# Altium schematic sheet GR_Alim_Puissance.SchDoc
size A4
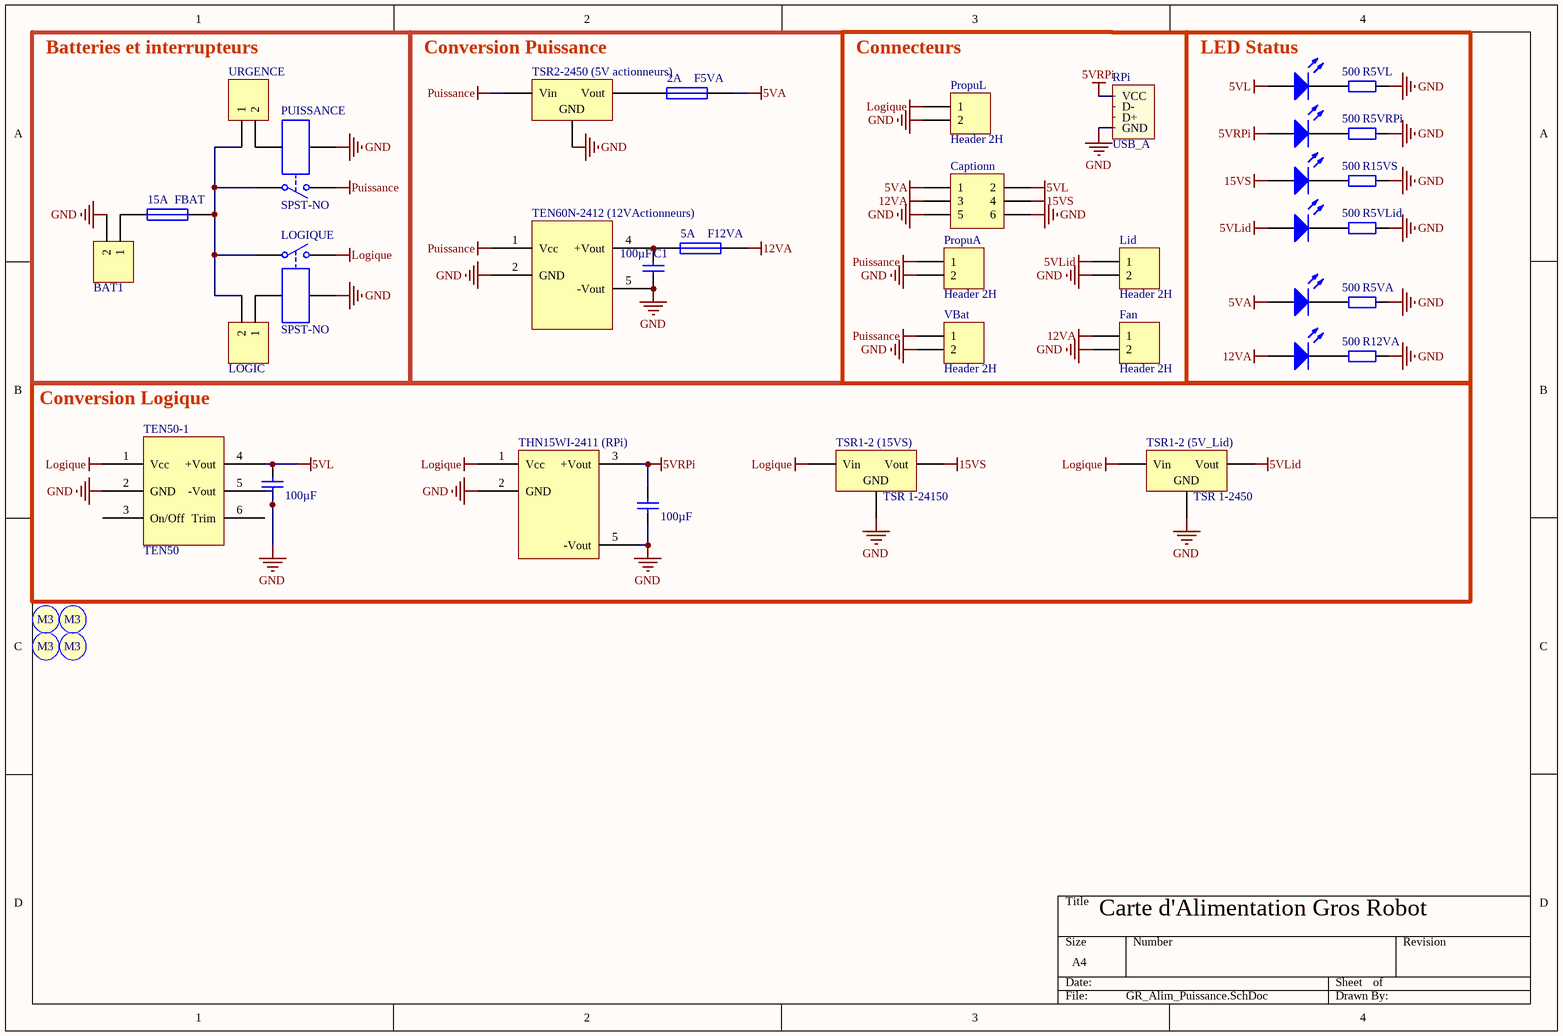
[diagram p0: GR_Alim_Puissance.SchDoc]

## Parts
BAT1  Batterie 1  [Battery SALE]  (value not drawn)
C1  value 100µF  [Condensateur]  (hidden comment: Cap)
C10  value 100µF  [Condensateur]  (hidden comment: Cap)
C20  value 100µF  [Condensateur]  (hidden comment: Cap)
Captionn  Header 3X2  [MOLEX_MINIFITJR_3X2]  (value not drawn)
D1  LED Logique 5V  [3.2X1.6X1.1]  (value not drawn)
D2  LED RPi 5V  [3.2X1.6X1.1]  (value not drawn)
D3  LED Sonars 15V  [3.2X1.6X1.1]  (value not drawn)
D4  LED Actionneurs 5V  [3.2X1.6X1.1]  (value not drawn)
D5  LED Actionneurs 12V  [3.2X1.6X1.1]  (value not drawn)
D6  LED Actionneurs 12V  [3.2X1.6X1.1]  (value not drawn)
F5VA  2A  [Fuse]
F12VA  5A  [Fuse]
Fan  Header 2H  [Molex SPOX 2x1H]
FBAT  15A  [Fuse]
Lid  Header 2H  [Molex_MiniFitJr_2x1H]
LOGIC  Logic  [MOLEX KK254 2X1H M]  (value not drawn)
LOGIQUE  SPST-NO  [Relay]
PropuA  Header 2H  [Molex_MiniFitJr_2x1H]
PropuL  Header 2H  [Molex_MiniFitJr_2x1H]
PUISSANCE  SPST-NO  [Relay]
R5VA  value 500  [3.2X1.6X1.1]  (hidden comment: Res4)
R5VL  value 500  [3.2X1.6X1.1]  (hidden comment: Res1)
R5VLid  value 500  [3.2X1.6X1.1]  (hidden comment: Res5)
R5VRPi  value 500  [3.2X1.6X1.1]  (hidden comment: Res2)
R12VA  value 500  [3.2X1.6X1.1]  (hidden comment: Res5)
R15VS  value 500  [3.2X1.6X1.1]  (hidden comment: Res3)
RPi  USB_A  [USB Connector]
S1  Screw M3  [Screw M3]  (value not drawn)
S2  Screw M3  [Screw M3]  (value not drawn)
S3  Screw M3  [Screw M3]  (value not drawn)
S4  Screw M3  [Screw M3]  (value not drawn)
TEN50-1  TEN50  [TRACO_1x1inch]
TEN60N-1  TEN60N-2412 (12VActionneurs)  [TRACO_2x1inch]
THN15-5  THN15WI-2411 (RPi)  [TRACO_1x1inch]
TSR1-2_(5V_Lid)  TSR 1-2450  [TRS]
TSR1-2_(15VS)  TSR 1-24150  [TRS]
TSR2-1  TSR2-2450 (5V actionneurs)  [TRS - centered]
URGENCE  Urgence  [MOLEX KK254 2X1H M]  (value not drawn)
VBat  Header 2H  [Molex_MiniFitJr_2x1H]

## Blocks framed on the sheet
Batteries et interrupteurs: BAT1 FBAT LOGIC LOGIQUE PUISSANCE URGENCE
Conversion Puissance: C1 F5VA F12VA TEN60N-1 TSR2-1
Conversion Logique: C10 C20 TEN50-1 THN15-5 TSR1-2_(5V_Lid) TSR1-2_(15VS)

## Nets
5VA: Captionn.1 D4.1(A) F5VA.2
5VL: C20.1 Captionn.2 D1.1(A) TEN50-1.4(+Vout)
5VLid: D6.1(A) Lid.1 TSR1-2_(5V_Lid).3(Vout)
5VRPi: C10.1 D2.1(A) RPi.1(VCC) THN15-5.3(+Vout)
12VA: Captionn.3 D5.1(A) F12VA.2 Fan.1
15VS: Captionn.4 D3.1(A) TSR1-2_(15VS).3(Vout)
GND: BAT1.2 C1.1 C10.2 C20.2 Captionn.5 Captionn.6 Fan.2 Lid.2 LOGIQUE.4 PropuA.2 PropuL.2 PUISSANCE.4 R5VA.2 R5VL.2 R5VLid.2 R5VRPi.2 R12VA.2 R15VS.2 RPi.4(GND) TEN50-1.2(GND) TEN50-1.5(-Vout) TEN60N-1.2(GND) TEN60N-1.5(-Vout) THN15-5.2(GND) THN15-5.5(-Vout) TSR1-2_(5V_Lid).2(GND) TSR1-2_(15VS).2(GND) TSR2-1.2(GND) VBat.2
Logique: LOGIQUE.2 PropuL.1 TEN50-1.1(Vcc) THN15-5.1(Vcc) TSR1-2_(5V_Lid).1(Vin) TSR1-2_(15VS).1(Vin)
Puissance: PropuA.1 PUISSANCE.2 TEN60N-1.1(Vcc) TSR2-1.1(Vin) VBat.1
NetBAT1_1: BAT1.1 FBAT.1
NetC1_2: C1.2 F12VA.1 TEN60N-1.4(+Vout)
NetD1_2: D1.2(K) R5VL.1
NetD2_2: D2.2(K) R5VRPi.1
NetD3_2: D3.2(K) R15VS.1
NetD4_2: D4.2(K) R5VA.1
NetD5_2: D5.2(K) R12VA.1
NetD6_2: D6.2(K) R5VLid.1
NetF5VA_1: F5VA.1 TSR2-1.3(Vout)
NetFBAT_2: FBAT.2 LOGIC.2 LOGIQUE.1 PUISSANCE.1 URGENCE.1
NetLOGIC_1: LOGIC.1 LOGIQUE.3
NetPUISSANCE_3: PUISSANCE.3 URGENCE.2

Not connected (* = marked no-connect by the designer): RPi 2(D-) 3(D+); TEN50-1 3(On/Off) 6(Trim); TEN60N-1 3(On/Off) 6(Trim); THN15-5 4(Trim) 6(On/Off)

## Notes on the sheet
- (near PropuL) Connecteurs
- (near D1) LED Status
- Carte d'Alimentation Gros Robot
- (in symbol Screw M3) M3

## Library data of the parts
BAT1 = Header 2: Header, 2-Pin; LatestRevisionDate: 17-Jul-2002; LatestRevisionNote: Re-released for DXP Platform.; Publisher: Altium Limited
C1 C10 C20 = Cap: Capacitor; Published: 8-Jun-2000; LatestRevisionDate: 17-Jul-2002; LatestRevisionNote: Re-released for DXP Platform.; PackageReference: RAD-0.3; Publisher: Altium Limited; PackageDescription: Radial Cap, Thru-Hole; 2 Leads; 0.3 in Pin Spacing
Captionn = Header 3X2: Header, 3-Pin, Dual row; pin to pad: 1>0 2>3 3>1 5>2 6>5; LatestRevisionDate: 17-Jul-2002; LatestRevisionNote: Re-released for DXP Platform.; Publisher: Altium Limited
D1-D6 = LED2: Typical RED, GREEN, YELLOW, AMBER GaAs LED; Published: 8-Jun-2000; LatestRevisionDate: 17-Jul-2002; LatestRevisionNote: Re-released for DXP Platform.; PackageReference: 3.2X1.6X1.1; Publisher: Altium Limited; PackageDescription: SM LED; 2 Flat Leads; PackageVersion: Feb-2002
F5VA F12VA FBAT = Fuse 1: Fuse; Published: 8-Jun-2000; LatestRevisionDate: 17-Jul-2002; LatestRevisionNote: Re-released for DXP Platform.; PackageReference: PIN-W2/E2.8; Publisher: Altium Limited; PackageDescription: Thru-Hole; 2 Leads
Fan Lid PropuA PropuL VBat = Header 2H: Header, 2-Pin, Right Angle; LatestRevisionDate: 17-Jul-2002; LatestRevisionNote: Re-released for DXP Platform.; Publisher: Altium Limited
LOGIC URGENCE = Header 2: Header, 2-Pin; pin to pad: 1>2 2>1; LatestRevisionDate: 17-Jul-2002; LatestRevisionNote: Re-released for DXP Platform.; Publisher: Altium Limited
LOGIQUE PUISSANCE = Relay-SPST: OJ-SS-124LMH2,005; Published: 24-Mar-1999; LatestRevisionDate: 17-Jul-2002; LatestRevisionNote: Re-released for DXP Platform.; PackageReference: MODULE4; Publisher: Altium Limited
R5VA R5VL R5VLid R5VRPi R12VA R15VS = Res2: Resistor; Published: 8-Jun-2000; LatestRevisionDate: 17-Jul-2002; LatestRevisionNote: Re-released for DXP Platform.; PackageReference: AXIAL-0.4; Publisher: Altium Limited; PackageDescription: Axial Device, Thru-Hole; 2 Leads; 0.4 in Pin Spacing
RPi = USB_A: pin to pad: 1>GND 2>D- 3>D+ 4>VCC
TEN50-1 = TEN50: TRACO TEN50; pin to pad: 3>4 4>3; LatestRevisionDate: 17-Jul-2002; LatestRevisionNote: Re-released for DXP Platform.; Publisher: Altium Limited
TEN60N-1 = TEN60N: TRACO TEN60N; LatestRevisionDate: 17-Jul-2002; LatestRevisionNote: Re-released for DXP Platform.; Publisher: Altium Limited
THN15-5 = THN15WI: LatestRevisionDate: 17-Jul-2002; LatestRevisionNote: Re-released for DXP Platform.; Publisher: Altium Limited
TSR1-2_(5V_Lid) TSR1-2_(15VS) TSR2-1 = Volt Reg: Voltage Regulator; Published: 24-Mar-1999; LatestRevisionDate: 29-May-2009; LatestRevisionNote: IPC-7351 Footprint Added.; PackageReference: D2PAK; Publisher: Altium Limited; PackageDescription: 3-Pin Transistor Outline Package 2.54 mm Pitch, 15.1 mm Lead Span